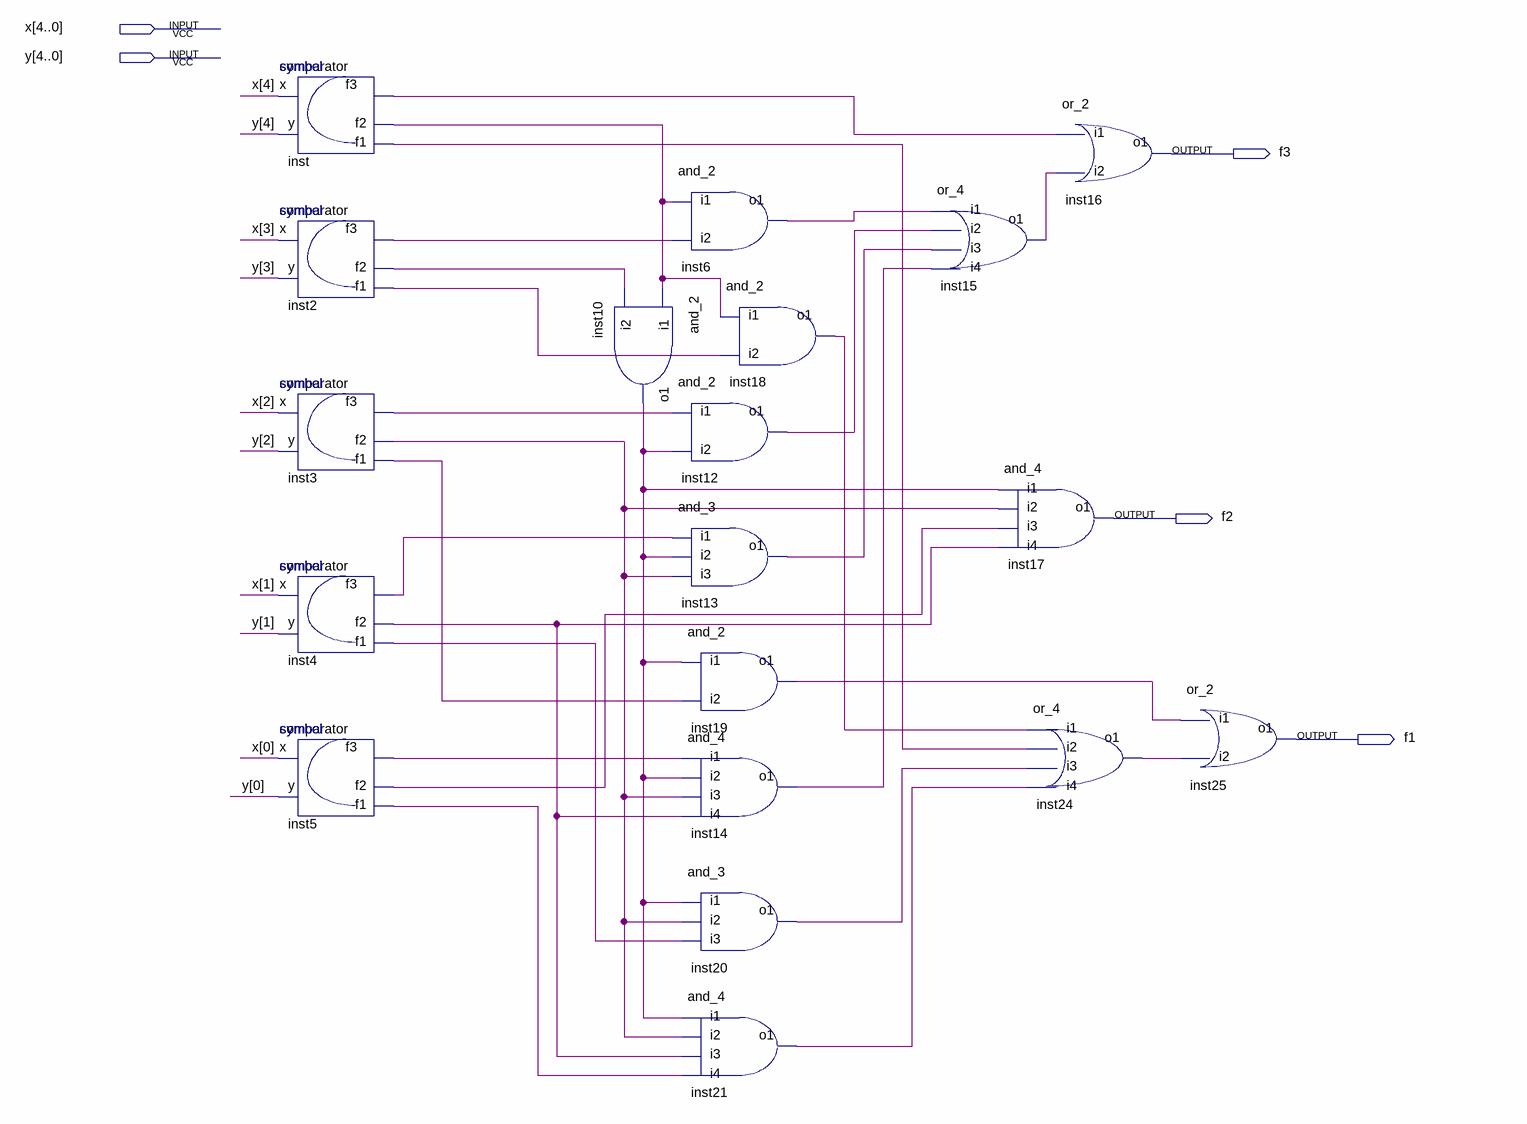
[diagram p0: schematic sheet]
// Quartus schematic comparator5.bdf as structural Verilog: 19 symbols, 5 pins
module comparator5 (
  input  [4:0] x,
  input  [4:0] y,
  output f3,
  output f2,
  output f1
);

  wire inst2_f1, inst2_f2, inst2_f3, inst3_f1, inst3_f2, inst3_f3, inst4_f1, inst4_f2, inst4_f3, inst5_f1,
       inst5_f2, inst5_f3, inst6_o1, inst10_o1, inst12_o1, inst13_o1, inst14_o1, inst15_o1, inst18_o1,
       inst19_o1, inst20_o1, inst21_o1, inst24_o1, inst_f1, inst_f2, inst_f3;

  comparator inst (.x(x[4]), .y(y[4]), .f3(inst_f3), .f2(inst_f2), .f1(inst_f1));
  comparator inst2 (.x(x[3]), .y(y[3]), .f3(inst2_f3), .f2(inst2_f2), .f1(inst2_f1));
  comparator inst3 (.x(x[2]), .y(y[2]), .f3(inst3_f3), .f2(inst3_f2), .f1(inst3_f1));
  comparator inst4 (.x(x[1]), .y(y[1]), .f3(inst4_f3), .f2(inst4_f2), .f1(inst4_f1));
  comparator inst5 (.x(x[0]), .y(y[0]), .f3(inst5_f3), .f2(inst5_f2), .f1(inst5_f1));
  and_2 inst10 (.i1(inst_f2), .i2(inst2_f2), .o1(inst10_o1));
  and_2 inst6 (.i1(inst_f2), .i2(inst2_f3), .o1(inst6_o1));
  and_2 inst12 (.i1(inst3_f3), .i2(inst10_o1), .o1(inst12_o1));
  and_3 inst13 (.i1(inst4_f3), .i2(inst10_o1), .i3(inst3_f2), .o1(inst13_o1));
  and_2 inst19 (.i1(inst10_o1), .i2(inst3_f1), .o1(inst19_o1));
  and_4 inst14 (.i1(inst5_f3), .i2(inst10_o1), .i3(inst3_f2), .i4(inst4_f2), .o1(inst14_o1));
  and_3 inst20 (.i1(inst10_o1), .i2(inst3_f2), .i3(inst4_f1), .o1(inst20_o1));
  and_4 inst21 (.i1(inst10_o1), .i2(inst3_f2), .i3(inst4_f2), .i4(inst5_f1), .o1(inst21_o1));
  and_2 inst18 (.i1(inst_f2), .i2(inst2_f1), .o1(inst18_o1));
  or_4 inst15 (.i1(inst6_o1), .i2(inst12_o1), .i3(inst13_o1), .i4(inst14_o1), .o1(inst15_o1));
  and_4 inst17 (.i1(inst10_o1), .i2(inst3_f2), .i3(inst5_f2), .i4(inst4_f2), .o1(f2));
  or_2 inst16 (.i1(inst_f3), .i2(inst15_o1), .o1(f3));
  or_4 inst24 (.i1(inst18_o1), .i2(inst_f1), .i3(inst20_o1), .i4(inst21_o1), .o1(inst24_o1));
  or_2 inst25 (.i1(inst19_o1), .i2(inst24_o1), .o1(f1));
endmodule
